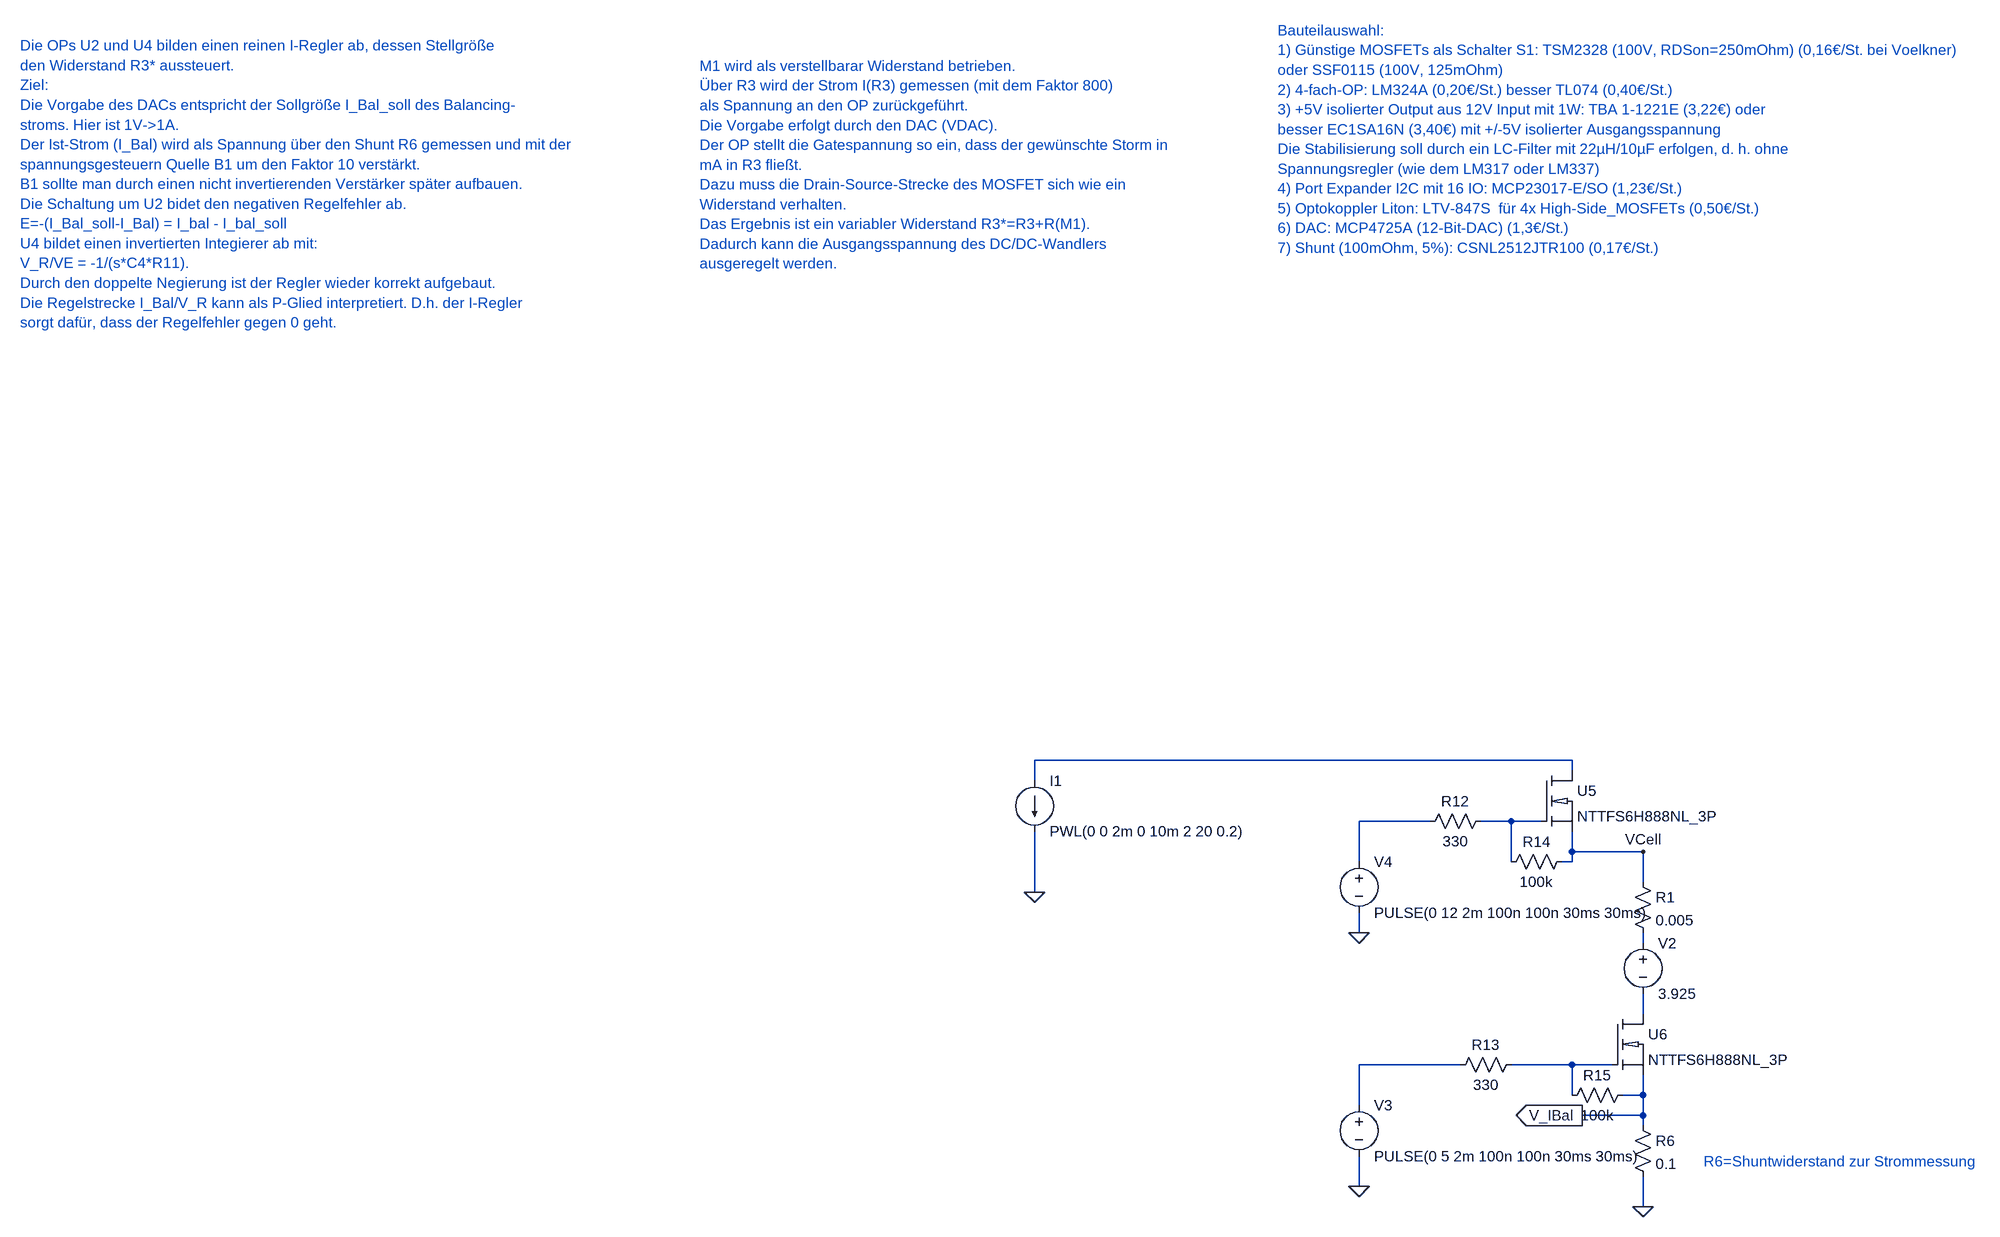
[diagram p0: schematic isoliert_step1_mosfet_ersetzen.asc]
isoliert_step1_mosfet_ersetzen.asc, the LTspice schematic file:
Version 4.1
SHEET 1 1832 860
WIRE 1248 -32 400 -32
WIRE 1248 -16 1248 -32
WIRE 400 0 400 -32
WIRE 1024 64 912 64
WIRE 1152 64 1104 64
WIRE 1200 64 1152 64
WIRE 1248 112 1248 80
WIRE 1360 112 1248 112
WIRE 912 128 912 64
WIRE 1152 128 1152 64
WIRE 1248 128 1248 112
WIRE 1248 128 1232 128
WIRE 1360 160 1360 112
WIRE 400 176 400 80
WIRE 912 240 912 208
WIRE 1360 256 1360 240
WIRE 1360 368 1360 336
WIRE 1072 448 912 448
WIRE 1248 448 1152 448
WIRE 1312 448 1248 448
WIRE 1248 496 1248 448
WIRE 1360 496 1360 464
WIRE 1360 496 1328 496
WIRE 912 512 912 448
WIRE 1360 528 1360 496
WIRE 1360 528 1264 528
WIRE 1360 544 1360 528
WIRE 912 640 912 592
WIRE 1360 672 1360 624
FLAG 1360 672 0
FLAG 1360 112 VCell
FLAG 912 640 0
FLAG 1264 528 V_IBal
IOPIN 1264 528 Out
FLAG 912 240 0
FLAG 400 176 0
SYMBOL res 1344 144 R0
SYMATTR InstName R1
SYMATTR Value 0.005
SYMBOL voltage 1360 240 R0
WINDOW 123 0 0 Left 0
WINDOW 39 0 0 Left 0
SYMATTR InstName V2
SYMATTR Value 3.925
SYMBOL voltage 912 496 R0
WINDOW 123 0 0 Left 0
WINDOW 39 0 0 Left 0
SYMATTR InstName V3
SYMATTR Value PULSE(0 5 2m 100n 100n 30ms 30ms)
SYMBOL res 1344 528 R0
SYMATTR InstName R6
SYMATTR Value 0.1
SYMBOL onsemi\ T8\ 80V\ Logic\ Level\ Model\ Library\\NTTFS6H888NL_3P 1200 -16 R0
SYMATTR InstName U5
SYMBOL onsemi\ T8\ 80V\ Logic\ Level\ Model\ Library\\NTTFS6H888NL_3P 1312 368 R0
SYMATTR InstName U6
SYMBOL voltage 912 112 R0
WINDOW 123 0 0 Left 0
WINDOW 39 0 0 Left 0
SYMATTR InstName V4
SYMATTR Value PULSE(0 12 2m 100n 100n 30ms 30ms)
SYMBOL res 1120 48 R90
WINDOW 0 0 56 VBottom 2
WINDOW 3 32 56 VTop 2
SYMATTR InstName R12
SYMATTR Value 330
SYMBOL res 1168 432 R90
WINDOW 0 0 56 VBottom 2
WINDOW 3 32 56 VTop 2
SYMATTR InstName R13
SYMATTR Value 330
SYMBOL res 1248 112 R90
WINDOW 0 0 56 VBottom 2
WINDOW 3 32 56 VTop 2
SYMATTR InstName R14
SYMATTR Value 100k
SYMBOL res 1344 480 R90
WINDOW 0 0 56 VBottom 2
WINDOW 3 32 56 VTop 2
SYMATTR InstName R15
SYMATTR Value 100k
SYMBOL current 400 0 R0
WINDOW 123 0 0 Left 0
WINDOW 39 0 0 Left 0
SYMATTR InstName I1
SYMATTR Value PWL(0 0 2m 0 10m 2 20 0.2)
TEXT -128 -1128 Left 2 ;M1 wird als verstellbarar Widerstand betrieben.\nÜber R3 wird der Strom I(R3) gemessen (mit dem Faktor 800)\nals Spannung an den OP zurückgeführt.\nDie Vorgabe erfolgt durch den DAC (VDAC).\nDer OP stellt die Gatespannung so ein, dass der gewünschte Storm in\nmA in R3 fließt.\nDazu muss die Drain-Source-Strecke des MOSFET sich wie ein \nWiderstand verhalten.\nDas Ergebnis ist ein variabler Widerstand R3*=R3+R(M1).\nDadurch kann die Ausgangsspannung des DC/DC-Wandlers\nausgeregelt werden.
TEXT -1200 -1160 Left 2 ;Die OPs U2 und U4 bilden einen reinen I-Regler ab, dessen Stellgröße \nden Widerstand R3* aussteuert.\nZiel: \nDie Vorgabe des DACs entspricht der Sollgröße I_Bal_soll des Balancing-\nstroms. Hier ist 1V->1A.\nDer Ist-Strom (I_Bal) wird als Spannung über den Shunt R6 gemessen und mit der \nspannungsgesteuern Quelle B1 um den Faktor 10 verstärkt.\nB1 sollte man durch einen nicht invertierenden Verstärker später aufbauen.\nDie Schaltung um U2 bidet den negativen Regelfehler ab.\nE=-(I_Bal_soll-I_Bal) = I_bal - I_bal_soll\nU4 bildet einen invertierten Integierer ab mit:\nV_R/VE = -1/(s*C4*R11). \nDurch den doppelte Negierung ist der Regler wieder korrekt aufgebaut.\nDie Regelstrecke I_Bal/V_R kann als P-Glied interpretiert. D.h. der I-Regler \nsorgt dafür, dass der Regelfehler gegen 0 geht.
TEXT 784 -1184 Left 2 ;Bauteilauswahl:\n1) Günstige MOSFETs als Schalter S1: TSM2328 (100V, RDSon=250mOhm) (0,16€/St. bei Voelkner)\noder SSF0115 (100V, 125mOhm)\n2) 4-fach-OP: LM324A (0,20€/St.) besser TL074 (0,40€/St.)\n3) +5V isolierter Output aus 12V Input mit 1W: TBA 1-1221E (3,22€) oder \nbesser EC1SA16N (3,40€) mit +/-5V isolierter Ausgangsspannung\nDie Stabilisierung soll durch ein LC-Filter mit 22µH/10µF erfolgen, d. h. ohne \nSpannungsregler (wie dem LM317 oder LM337) \n4) Port Expander I2C mit 16 IO: MCP23017-E/SO (1,23€/St.)\n5) Optokoppler Liton: LTV-847S  für 4x High-Side_MOSFETs (0,50€/St.)\n6) DAC: MCP4725A (12-Bit-DAC) (1,3€/St.)\n7) Shunt (100mOhm, 5%): CSNL2512JTR100 (0,17€/St.)
TEXT 1456 600 Left 2 ;R6=Shuntwiderstand zur Strommessung

The netlist it stands for:
* isoliert_step1_mosfet_ersetzen.asc
R1 VCell N004 0.005
V2 N004 N005 3.925
V3 N006 0 PULSE(0 5 2m 100n 100n 30ms 30ms)
R6 V_IBal 0 0.1
X§U5 N001 N003 VCell NTTFS6H888NL_3P  ; pins D G S
X§U6 N005 N007 V_IBal NTTFS6H888NL_3P  ; pins D G S
V4 N002 0 PULSE(0 12 2m 100n 100n 30ms 30ms)
R12 N003 N002 330
R13 N007 N006 330
R14 VCell N003 100k
R15 V_IBal N007 100k
I1 N001 0 PWL(0 0 2m 0 10m 2 20 0.2)
* M1 wird als verstellbarar Widerstand betrieben.
* Über R3 wird der Strom I(R3) gemessen (mit dem Faktor 800)
* als Spannung an den OP zurückgeführt.
* Die Vorgabe erfolgt durch den DAC (VDAC).
* Der OP stellt die Gatespannung so ein, dass der gewünschte Storm in
* mA in R3 fließt.
* Dazu muss die Drain-Source-Strecke des MOSFET sich wie ein
* Widerstand verhalten.
* Das Ergebnis ist ein variabler Widerstand R3*=R3+R(M1).
* Dadurch kann die Ausgangsspannung des DC/DC-Wandlers
* ausgeregelt werden.
* Die OPs U2 und U4 bilden einen reinen I-Regler ab, dessen Stellgröße
* den Widerstand R3* aussteuert.
* Ziel:
* Die Vorgabe des DACs entspricht der Sollgröße I_Bal_soll des Balancing-
* stroms. Hier ist 1V->1A.
* Der Ist-Strom (I_Bal) wird als Spannung über den Shunt R6 gemessen und mit der
* spannungsgesteuern Quelle B1 um den Faktor 10 verstärkt.
* B1 sollte man durch einen nicht invertierenden Verstärker später aufbauen.
* Die Schaltung um U2 bidet den negativen Regelfehler ab.
* E=-(I_Bal_soll-I_Bal) = I_bal - I_bal_soll
* U4 bildet einen invertierten Integierer ab mit:
* V_R/VE = -1/(s*C4*R11).
* Durch den doppelte Negierung ist der Regler wieder korrekt aufgebaut.
* Die Regelstrecke I_Bal/V_R kann als P-Glied interpretiert. D.h. der I-Regler
* sorgt dafür, dass der Regelfehler gegen 0 geht.
* Bauteilauswahl:
* 1) Günstige MOSFETs als Schalter S1: TSM2328 (100V, RDSon=250mOhm) (0,16€/St. bei Voelkner)
* oder SSF0115 (100V, 125mOhm)
* 2) 4-fach-OP: LM324A (0,20€/St.) besser TL074 (0,40€/St.)
* 3) +5V isolierter Output aus 12V Input mit 1W: TBA 1-1221E (3,22€) oder
* besser EC1SA16N (3,40€) mit +/-5V isolierter Ausgangsspannung
* Die Stabilisierung soll durch ein LC-Filter mit 22µH/10µF erfolgen, d. h. ohne
* Spannungsregler (wie dem LM317 oder LM337)
* 4) Port Expander I2C mit 16 IO: MCP23017-E/SO (1,23€/St.)
* 5) Optokoppler Liton: LTV-847S  für 4x High-Side_MOSFETs (0,50€/St.)
* 6) DAC: MCP4725A (12-Bit-DAC) (1,3€/St.)
* 7) Shunt (100mOhm, 5%): CSNL2512JTR100 (0,17€/St.)
* R6=Shuntwiderstand zur Strommessung
.backanno
.end